# EAGLE design board (EAGLE 9.6.2)
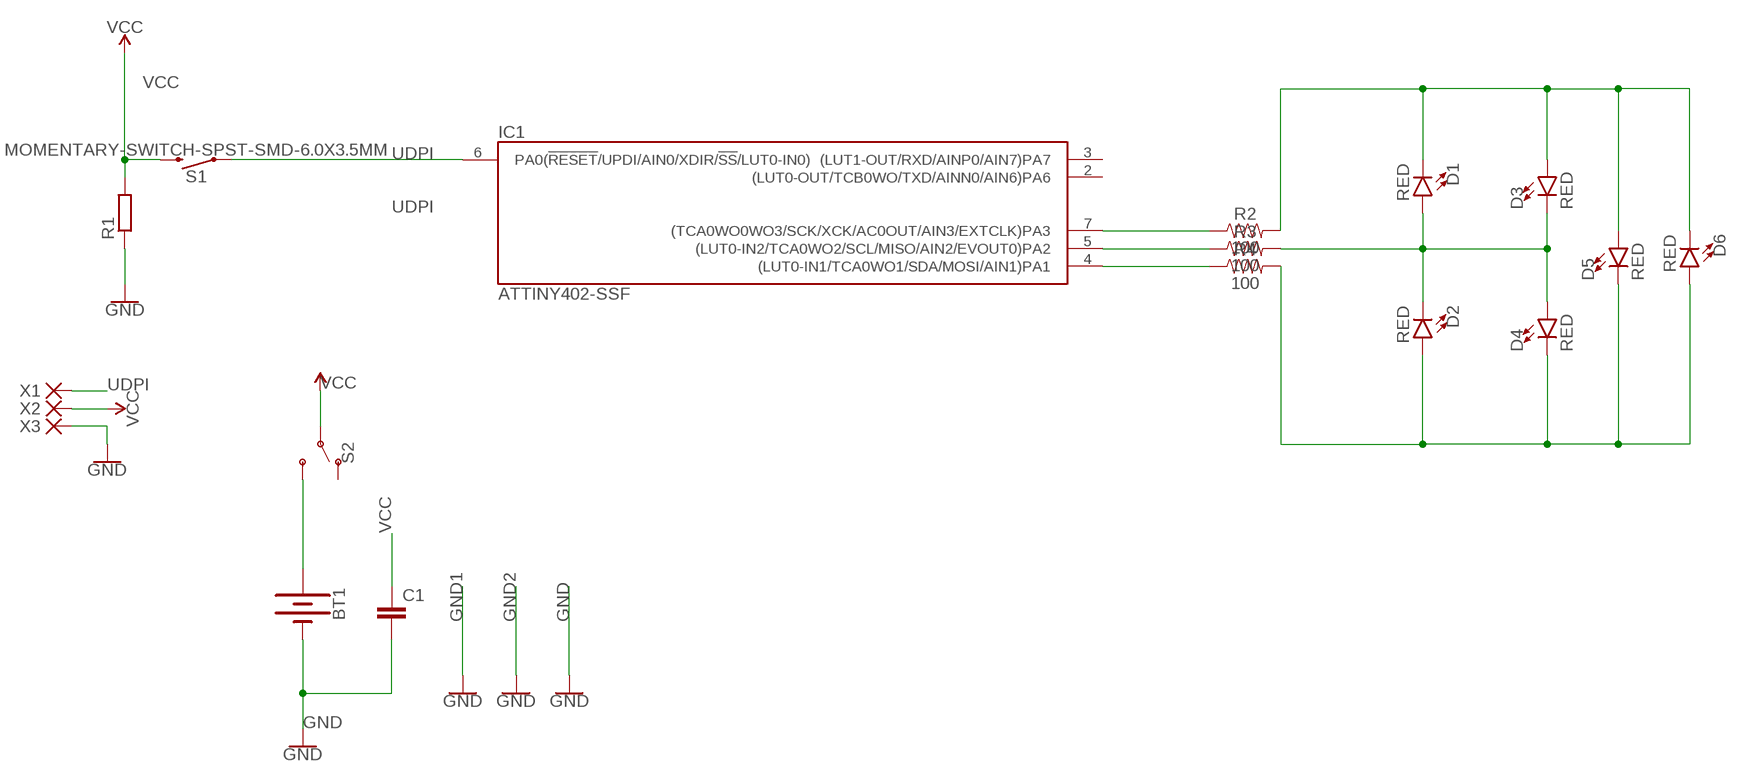
[diagram p0: schematic, sheet 1]

## Parts
BT1  BATTERY-20MM_SMD  [BATTCON_20MM]
C1  C-EUC0805  [C0805]
D1  RED  LED-RED0603  [LED-0603]
D2  RED  LED-RED0603  [LED-0603]
D3  RED  LED-RED0603  [LED-0603]
D4  RED  LED-RED0603  [LED-0603]
D5  RED  LED-RED0603  [LED-0603]
D6  RED  LED-RED0603  [LED-0603]
IC1  ATTINY402-SSF  [SO8]
R1  R-EU_R0603  [R0603]
R2  100  100OHM-0603-1/10W-1%  [0603]
R3  100  100OHM-0603-1/10W-1%  [0603]
R4  100  100OHM-0603-1/10W-1%  [0603]
S1  MOMENTARY-SWITCH-SPST-SMD-6.0X3.5MM  [TACTILE_SWITCH_SMD_6.0X3.5MM]
S2  SWITCH-SPDT-SMD-RIGHT-ANGLE  [SWITCH_SPST_SMD_A]
X1  PAD-1.27X2.54  [PAD-1.27X2.54]
X2  PAD-1.27X2.54  [PAD-1.27X2.54]
X3  PAD-1.27X2.54  [PAD-1.27X2.54]

## Nets
GND [New Class]: BT1.2(-) C1.2 R1.1 X3.1(P)
N$1: D1.C D3.A D5.A D6.C R2.2
N$2: IC1.7((TCA0WO0WO3/SCK/XCK/AC0OUT/AIN3/EXTCLK)PA3) R2.1
N$3: IC1.5((LUT0-IN2/TCA0WO2/SCL/MISO/AIN2/EVOUT0)PA2) R3.1
N$4: IC1.4((LUT0-IN1/TCA0WO1/SDA/MOSI/AIN1)PA1) R4.1
N$5: D2.A D4.C D5.C D6.A R4.2
N$6: BT1.1(+) S2.3(S)
N$7: D1.A D2.C D3.C D4.A R3.2
UDPI: IC1.6(PA0(!RESET!/UPDI/AIN0/XDIR/!SS!/LUT0-IN0)) S1.1 X1.1(P)
VCC: C1.1 R1.2 S1.2 S2.2(P) X2.1(P)
Unconnected: IC1.2((LUT0-OUT/TCB0WO/TXD/AINN0/AIN6)PA6) IC1.3((LUT1-OUT/RXD/AINP0/AIN7)PA7) S2.1(O)

## Power pins joined to a net without a drawn wire
GND: IC1.8(GND)
VCC: IC1.1(VCC)

## Library data of the parts
BT1 = SparkFun-Batteries:BATTERY: Battery - Single Cell A variety of battery chemistries, sizes, and footprints. Device List: 20MM_PTH - Coin Cell Battery Holder - 20mm (PTH) 20MM_PTH_KIT- Coin Cell battery Holder - 20 mm (PTH) kit version with special mask 6.8MM_PTH - Coin Cell Battery Holder - 6.8MM(SMD) 12MM_SMD - Coin Cell Battery Holder - 12mm (SMD) 12MM_PTH - Coin Cell Battery Holder - 12mm (PTH) 20MM_SMD - 20mm Coin Cell Battery Holder (SMD) (2 legs) Used on the Big Time Watch Kit 20MM_SMD_4LEGS - Coin Cell Battery Holder - 20mm (SMD) 20MM_SMD_4LEGS_OVERPASTE - Coin Cell Battery Holder - 20mm (SMD) (Over-paste on the legs) 24.5MM_PTH - Coin Cell Battery Holder - 24.5mm (PTH) 9V - 9V Battery Holder - PC Mount Used on the SparkFun SparkPunk Sound Kit and SparkFun SparkPunk Sequencer Kit 18650 - Battery Holder - 18650 (PTH) AA - Battery Holder - 1xAA (PTH) AAA - Battery Holder - 1xAAA (PTH) AA_KIT - Battery Holder - 1xAA (PTH) Special kit package - pads only have exposed copper on one side of the board. AAA_KIT - Battery Holder - 1xAAA (PTH) Special kit package - pads only have exposed copper on one side of the board.; PROD_ID: BATT-11519
C1 = rcl:C-EU: CAPACITOR, European symbol; SPICEPREFIX: C
D1-D6 = SparkFun-LED:LED-RED: Red SMD LED Used in manufacturing of most products at SparkFun Packages: 0603 - SMD 0603 package [Product Link] <http://docs.avagotech.com/docs/AV02-0551EN> 0603 SMART - SMD 0603 SMART package ( more efficient and expensive)[Product Link] <http://www.osram-os.com/Graphics/XPic2/00077099_0.pdf> 1206 - SMD1206 package [Product Link] <https://www.sparkfun.com/datasheets/DevTools/LilyPad/Q150OVS4.pdff> SparkFun Products: Pro Mini 328 -5V <https://www.sparkfun.com/products/821> RedBoard <https://www.sparkfun.com/products/12757> IOIO-OTG <https://www.sparkfun.com/products/13613>; PROD_ID: DIO-00819
IC1 = atmel (1):ATTINY*02: 8-bit AVR tiny-0-series Microcontroller CPU: two-cycle hardware multiplier single pin Unified Program Debug Interface (UPDI) programmable watchdog timer with separate on-chip oscillator programmable brown-out detection circuit with software disable function internal calibrated oscillator Status active active ATtiny202 ATtiny402 General purpose working registers 32 SRAM 128 B 256 B Flash 2 kB 4 kB EEPROM 64 B 128 B 16-bit Timer/Counter type A (TCA) 1 16-bit Timer/Counter type B (TCB) 1 Real Time Counter (RTC) 1 USART 1 SPI 1 TWI (I2C) 1 ADC 1 ADC channels 6 ADC resolution 10 bit AC 1 Custom Configurable Logic/Lookup tables 1/2 Window Watchdog 1 Event System channels 3 General purpose I/O 6 External interrupts 6 CRCSCAN 1 Operating voltage 1.8 ... 5.5 V Speed grade 0 ... 5 MHz @ 1.8 ... 5.5 V 0 ... 10 MHz @ 2.7 ... 5.5 V 0 ... 20 MHz @ 4.5 ... 5.5 V Clock options internal 16/20 MHz low power RC oscillator internal 32.768 kHz ultra low power RC oscillator external clock input Pin Name Other/Special ADC0 AC0 USART0 SPI0 TWI0 TCA0 TCB0 CCL PA0 !RESET, UPDI AIN0 XDIR !SS LUT0-IN0 PA1 AIN1 TxD MOSI SDA WO1 LUT0-IN1 PA2 EVOUT0 AIN2 RxD MISO SCL WO2 LUT0-IN2 PA3 EXTCLK AIN3 OUT XCK SCK WO0/WO3 PA6 AIN6 AINN0 TxD MOSI WO LUT0-OUT PA7 AIN7 AINP0 RxD MISO WO0 LUT1-OUT
R1 = rcl:R-EU_: RESISTOR, European symbol; SPICEPREFIX: R
R2-R4 = SparkFun-Resistors:100OHM: 100Ω resistor A resistor is a passive two-terminal electrical component that implements electrical resistance as a circuit element. Resistors act to reduce current flow, and, at the same time, act to lower voltage levels within circuits. - Wikipedia; PROD_ID: RES-07863
S1 = SparkFun-Switches:MOMENTARY-SWITCH-SPST: Momentary Switch (Pushbutton) - SPST Normally-open (NO) SPST momentary switches (buttons, pushbuttons). Variants PTH-12MM - 12mm square, through-hole Momentary Pushbutton Switch - 12mm Square (COM-09190) PTH-6.0MM, PTH-6.0MM-KIT - 6.0mm square, through-hole Mini Pushbutton Switch (COM-00097) KIT package intended for soldering kit's - only one side of pads' copper is exposed. PTH-RIGHT-ANGLE-KIT - Right-angle, through-hole Right Angle Tactile Button - Used on SparkFun BigTime Watch Kit SMD-12MM - 12mm square, surface-mount Tactile Button - SMD (12mm) (COM-12993) Used on SparkFun PicoBoard SMD-4.5MM - 4.5mm Square Trackball Switch Used on SparkFun Blackberry Trackballer Breakout SMD-4.6MMX2.8MM - 4.60mm x 2.80mm, surface mount Used on SparkFun SAMD21 Mini Breakout SMD-5.2MM, SMD-5.2-REDUNDANT - 5.2mm square, surface-mount Mini Pushbutton Switch - SMD (COM-08720) Used on Arduino Pro Mini REDUNDANT package connects both switch circuits together SMD-6.0X3.5MM - 6.0 x 3.5mm, surface mount Momentary Reset Switch SMD (COM-08229) SMD-6.2MM-TALL - 6.2mm square, surface mount Tactile Button - SMD (6mm) Used on SparkFun Digital Sandbox SMD-RIGHT-ANGLE - Right-angle, surface mount Used on SparkFun Block for Intel® Edison - Arduino; PROD_ID: SWCH-14278; SF_SKU: COM-08229
S2 = SparkFun-Switches:SWITCH-SPDT: Single Pole, Double Throw (SPDT) Switch Single-pole, double-throw (SPDT) switch. Variant Overview SMD-AYZ0202 Surface Mount DPDT Switch (COM-00597) Used on e.g. LilyPad Arduino USB - ATmega32U4 Board PTH-11.6X4.0MM SPDT Mini Power Switch (COM-00102) Used on e.g. SparkFun Simon Says - Through-Hole Soldering Kit (KIT-10547) PTH-11.6X4.0MM-KIT KIT version of SPDT Mini Power Switch - Simplifies soldering by removing tStop of switch pins - only one side can be soldered. PTH-11.6X4.0MM-LOCK LOCK version of SPDT Mini Power Switch - Offset pins hold switch in place for easier soldering. SMD-RIGHT-ANGLE Surface Mount Right Angle Switch (COM-10860) Used on e.g. SparkFun ESP8266 Thing; PROD_ID: SWCH-10651; SF_SKU: COM-10860
X1-X3 = we-rcl:PAD: Pad / Test-Point

## Board
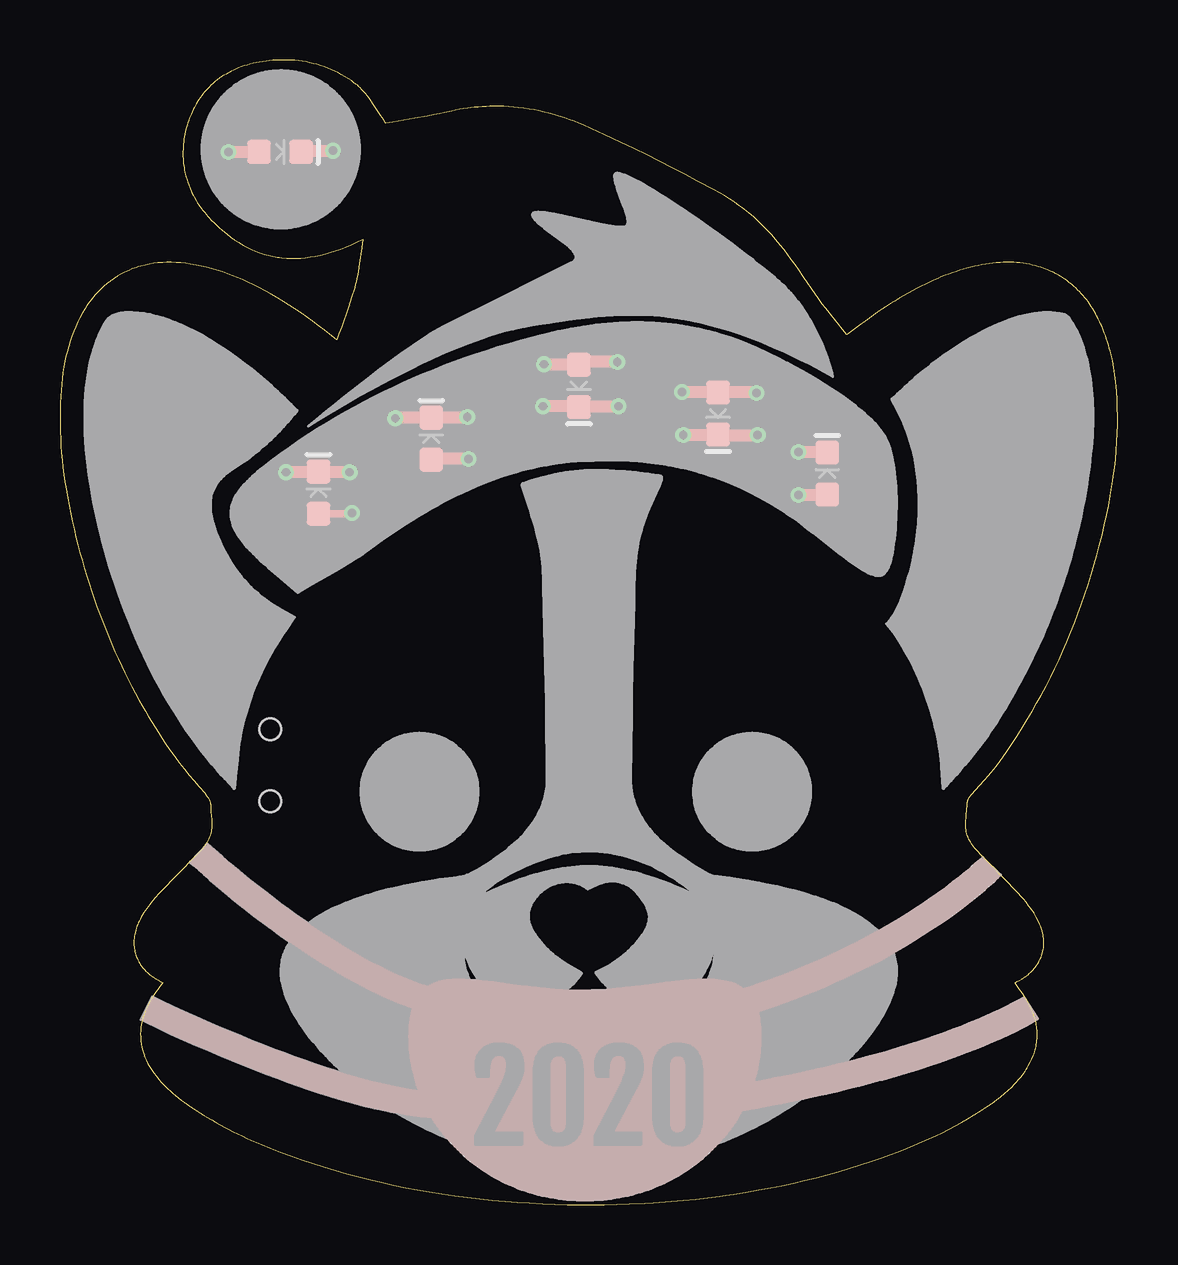
[diagram p1: board, top side]
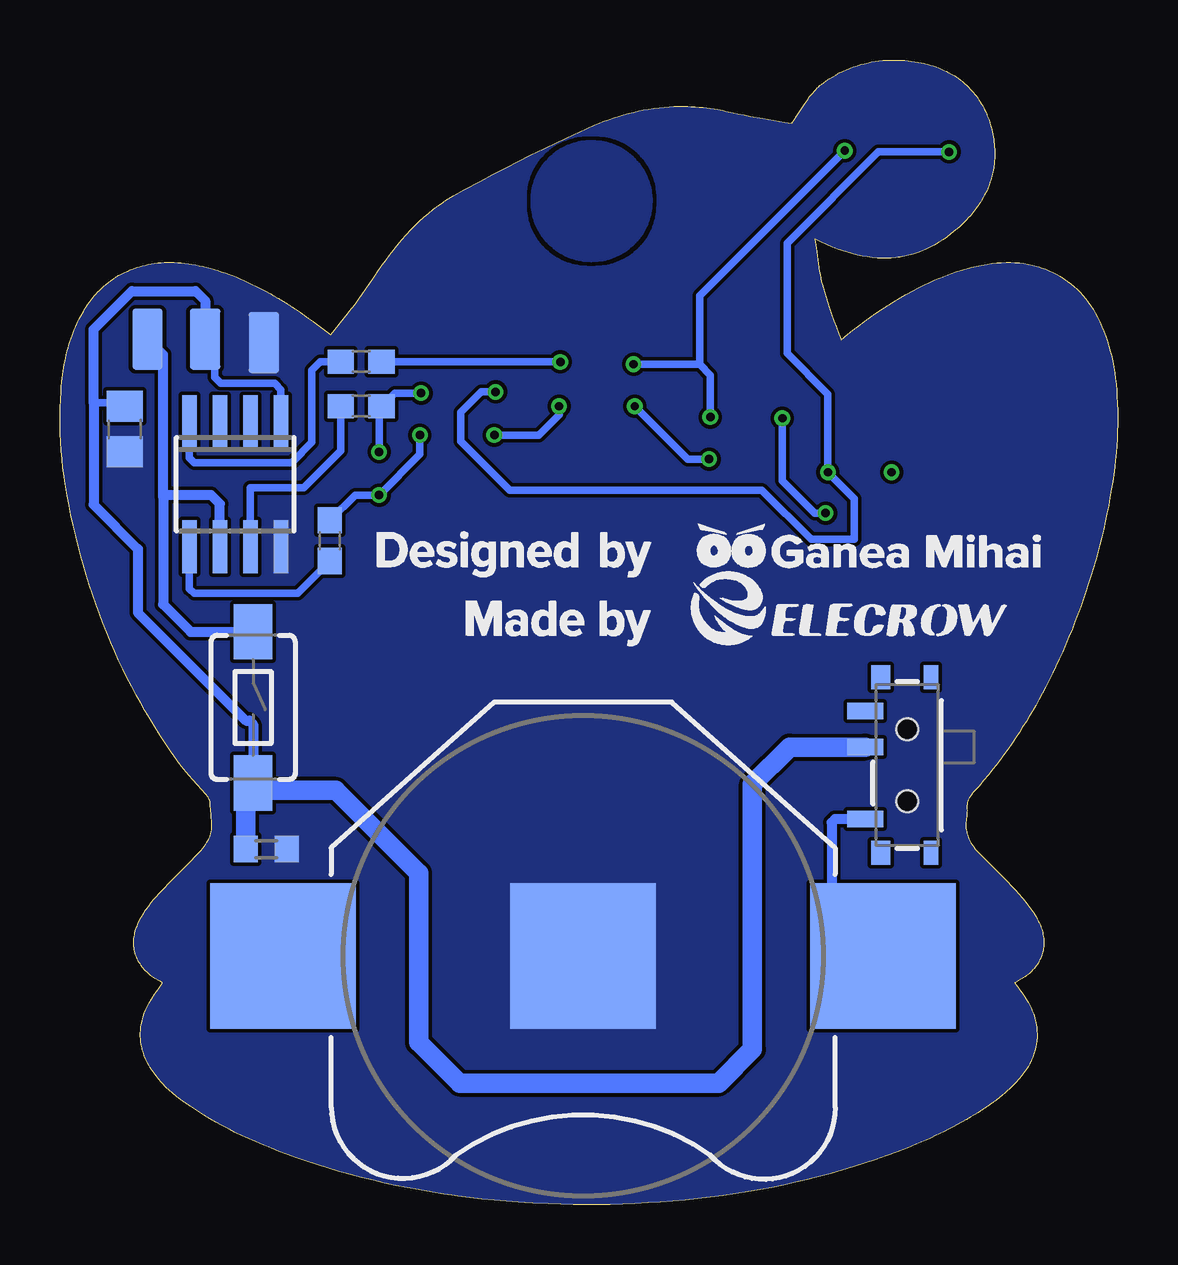
[diagram p2: board, bottom side, seen from below]

Size 44.07 x 47.7 mm. Coordinates in mm from the lower left corner, seen from the top.
Outline: 852 segments
Copper layers (1*16): Top 0.035mm / dielectric 1.6mm / Bottom 0.035mm
Design rules "Elecrow_2-layer_PCB_eagle_rule *": minimum track width 6mil, minimum drill 12mil, track to track 6mil, track to pad 6mil, pad to pad 6mil, via to via 8mil, smd to smd 0mil, copper to edge 0mil, drill to drill 10mil, minimum pad ring 6mil, minimum via ring 6mil, stop-mask expansion 0mil, vias tented up to drill 100mil, thermal gap 0mil
tRestrict: area 1,17.3 to 9.9,37.2; area 34.4,17.3 to 43,37.2; area 17.3,2.5 to 19.3,6.7; area 19.7,2.5 to 21.8,6.7; area 22.3,2.5 to 24.3,6.7; area 24.7,2.5 to 26.8,6.7

### Footprints (pad centres in the part's own frame; a part is rotated, then mirrored left to right if it is on the bottom)
BATTCON_20MM = smd 6.07 x 6.07: 1 -12.5,0; 2 0,0; 3 12.5,0
C0805 = smd 1.3 x 1.5: 1 -0.95,0; 2 0.95,0
LED-0603 = smd 1 x 1: A -0.877,0; C 0.877,0
SO8 = smd 0.6 x 2.2: 1 -1.905,-2.6; 2 -0.635,-2.6; 3 0.635,-2.6; 4 1.905,-2.6; 5 1.905,2.6; 6 0.635,2.6; 7 -0.635,2.6; 8 -1.905,2.6
R0603 = smd 1 x 1.1: 1 -0.85,0; 2 0.85,0
0603 = smd 1.1 x 1: 1 -0.85,0; 2 0.85,0
TACTILE_SWITCH_SMD_6.0X3.5MM = smd 2.3 x 1.6: 1 -3.15,0; 2 3.15,0
SWITCH_SPST_SMD_A = smd 0.7 x 1.5: 1 -2.25,-1.75; 2 -0.75,-1.75; 3 2.25,-1.75 | smd 1 x 0.6: GND1 -3.65,1; GND3 3.65,1 | smd 1 x 0.8: GND2 -3.65,-1.1; GND4 3.65,-1.1 | hole 0.9: -1.5,0; 1.5,0
PAD-1.27X2.54 = smd 1.27 x 2.54: 1 0,0

### Placement (x,y rotation side)
BT1  22.27,10.37 180 bottom
C1  41.37,32.32 270 bottom
D1  31.97,30.47 90 top
D2  21.62,34.12 270 top
D3  27.42,32.97 270 top
D4  15.47,31.92 90 top
D5  9.17,43.87 0 top
D6  10.77,29.67 90 top
IC1  36.77,30.02 180 bottom
R1  35.47,14.82 180 bottom
R2  31.52,33.27 0 bottom
R3  32.82,27.67 90 bottom
R4  31.52,35.12 0 bottom
S1  36.02,20.72 270 bottom
S2  8.77,18.32 270 bottom
X1  40.42,36.07 0 bottom
X2  38.02,36.07 0 bottom
X3  35.57,35.92 0 bottom

### Tracks (layer width: path | path; a pad name or v marks a point on that pad's centre or on a via)
GND
  pour Top (rank 3): 228 corners
  pour Top (rank 3): 230 corners
  pour Top (rank 3): 230 corners
  pour Top (no thermals): 15.72,7.9 15.95,8.93 15.71,8.99 15.47,9.06 15.24,9.13 14.97,9.22 14.7,9.31 14.44,9.42 14.18,9.52 13.89,9.65 13.6,9.79 13.32,9.93 13.03,10.07 12.72,10.24 12.42,10.41 12.11,10.58 11.81,10.77 11.51,10.95 11.18,11.16 10.85,11.37 10.53,11.58 10.21,11.8 9.86,12.05 9.52,12.3 9.18,12.55 8.84,12.8 8.48,13.08 8.15,13.34 7.79,13.63 7.46,13.9 7.11,14.19 6.76,14.49 6.44,14.77 6.16,15.03 6.13,15.03 5.43,14.28 5.43,14.26 5.59,14.12 5.8,13.93 6.01,13.74 6.25,13.53 6.49,13.33 6.87,13.01 7.28,12.68 7.66,12.37 8.08,12.04 8.45,11.77 8.82,11.49 9.19,11.22 9.53,10.98 9.88,10.74 10.23,10.5 10.59,10.27 10.94,10.05 11.28,9.85 11.61,9.65 11.92,9.47 12.26,9.28 12.57,9.12 12.88,8.96 13.2,8.81 13.49,8.67 13.78,8.55 14.07,8.42 14.37,8.31 14.63,8.21 14.9,8.12 15.17,8.04 15.44,7.97 15.58,7.93
  pour Top (rank 3): 16.08,3.61 16.08,4.67 15.87,4.67 15.63,4.68 15.38,4.7 15.1,4.73 14.82,4.77 14.54,4.81 14.23,4.87 13.91,4.93 13.6,4.99 13.26,5.08 12.95,5.15 12.58,5.25 12.2,5.36 11.83,5.47 11.46,5.58 11.06,5.71 10.62,5.85 10.22,5.99 9.79,6.15 9.36,6.3 8.93,6.47 8.47,6.64 7.98,6.84 7.55,7.01 7.09,7.2 6.57,7.42 6.09,7.63 5.64,7.83 5.15,8.05 4.7,8.25 4.22,8.48 3.84,8.66 3.82,8.63 3.37,7.72 3.4,7.7 3.53,7.64 4.1,7.36 4.64,7.11 5.16,6.88 5.67,6.65 6.19,6.43 6.71,6.21 7.17,6.02 7.63,5.83 8.32,5.56 8.35,5.55 8.37,5.54 9.04,5.29 9.47,5.13 9.94,4.97 10.37,4.82 10.81,4.67 11.21,4.55 11.62,4.42 11.99,4.32 12.37,4.21 12.74,4.11 13.08,4.03 13.43,3.95 13.77,3.88 14.12,3.81 14.43,3.76 14.75,3.71 15.03,3.67 15.31,3.65 15.59,3.62 15.84,3.61
  pour Top (rank 3): 27.83,7.68 28.27,7.8 28.67,7.93 29.08,8.06 29.48,8.19 29.88,8.33 30.28,8.47 30.67,8.62 31.1,8.79 31.49,8.95 31.88,9.11 32.27,9.28 32.65,9.46 33.04,9.64 34.17,10.19 35.24,10.82 35.58,11.02 35.93,11.24 36.29,11.47 36.61,11.68 36.96,11.92 37.28,12.15 37.62,12.4 37.92,12.64 38.23,12.88 38.53,13.13 38.79,13.36 38.95,13.5 39.08,13.62 39.18,13.72 39.2,13.75 38.46,14.46 38.44,14.48 38.34,14.38 38.23,14.29 38,14.08 37.76,13.87 37.48,13.65 37.21,13.43 36.9,13.2 36.58,12.97 36.27,12.74 35.95,12.52 35.62,12.31 35.3,12.1 34.97,11.9 34.25,11.47 33.63,11.14 33.21,10.92 32.87,10.74 32.49,10.56 32.13,10.39 31.78,10.23 31.39,10.06 31.04,9.91 30.64,9.75 30.28,9.61 29.89,9.46 29.52,9.33 29.12,9.19 28.75,9.06 28.35,8.94 27.98,8.82 27.54,8.7
  pour Top (rank 3): 28.05,3.87 28.57,3.96 29.06,4.05 29.54,4.14 30.03,4.23 30.51,4.33 30.96,4.42 31.48,4.53 31.93,4.63 32.38,4.74 32.82,4.84 33.3,4.96 33.74,5.08 34.19,5.2 34.26,5.2 35.79,5.68 36.21,5.81 36.62,5.95 37.02,6.09 37.41,6.23 37.78,6.37 38.14,6.51 38.5,6.65 38.86,6.8 39.21,6.96 39.53,7.11 39.85,7.26 40.04,7.35 40.2,7.44 40.48,7.59 40.6,7.66 40.72,7.73 40.73,7.75 40.18,8.62 40.15,8.63 39.97,8.52 39.72,8.38 39.44,8.24 39.15,8.1 38.87,7.97 38.54,7.83 38.22,7.69 37.89,7.55 37.56,7.42 37.2,7.28 36.84,7.15 36.47,7.02 36.1,6.9 35.74,6.77 35.31,6.64 34.2,6.29 34.16,6.29 34.15,6.29 33.74,6.18 33.3,6.06 32.85,5.95 32.44,5.84 32,5.74 31.58,5.64 31.14,5.54 30.69,5.44 30.27,5.36 29.79,5.26 29.34,5.17 28.85,5.09 28.36,5 27.88,4.92
  pour Bottom (rank 3): 838 corners
  pour Bottom (rank 3): 24.42,41.82 24.41,41.98 24.41,42.08 24.4,42.14 24.38,42.24 24.36,42.34 24.34,42.45 24.31,42.55 24.28,42.65 24.24,42.75 24.22,42.8 24.18,42.89 24.13,42.99 24.1,43.04 24.05,43.13 23.99,43.22 23.93,43.3 23.87,43.39 23.83,43.43 23.8,43.47 23.73,43.54 23.65,43.62 23.58,43.69 23.5,43.76 23.45,43.79 23.41,43.82 23.33,43.89 23.24,43.94 23.19,43.97 23.1,44.02 23.01,44.07 22.91,44.12 22.81,44.16 22.76,44.17 22.66,44.21 22.56,44.24 22.46,44.26 22.35,44.28 22.25,44.3 22.14,44.31 21.99,44.32 21.88,44.32 21.77,44.32 21.62,44.3 21.51,44.29 21.41,44.27 21.3,44.24 21.2,44.21 21.1,44.18 21,44.15 20.95,44.13 20.9,44.1 20.81,44.06 20.72,44.01 20.62,43.96 20.53,43.9 20.45,43.84 20.36,43.78 20.32,43.74 20.28,43.71 20.2,43.64 20.13,43.56 20.09,43.53 20.02,43.45 19.95,43.36 19.89,43.28 19.83,43.19 19.8,43.15 19.77,43.1 19.72,43.01 19.67,42.92 19.63,42.82 19.59,42.72 19.55,42.62 19.54,42.57 19.51,42.47 19.48,42.37 19.46,42.27 19.44,42.16 19.43,42.06 19.42,41.9 19.42,41.79 19.42,41.69 19.43,41.58 19.44,41.53 19.45,41.42 19.47,41.32 19.48,41.27 19.51,41.17 19.54,41.06 19.57,40.96 19.61,40.87 19.63,40.82 19.67,40.72 19.72,40.63 19.77,40.53 19.83,40.45 19.89,40.36 19.95,40.27 19.99,40.23 20.02,40.19 20.09,40.11 20.17,40.04 20.2,40 20.28,39.93 20.36,39.86 20.45,39.8 20.53,39.74 20.58,39.71 20.62,39.68 20.72,39.63 20.81,39.58 20.9,39.53 21,39.49 21.1,39.46 21.2,39.42 21.25,39.41 21.36,39.38 21.46,39.36 21.56,39.34 21.67,39.33 21.77,39.32 21.93,39.32 22.04,39.32 22.14,39.33 22.25,39.34 22.3,39.35 22.41,39.37 22.46,39.38 22.56,39.4 22.66,39.43 22.76,39.46 22.86,39.5 22.91,39.52 23.01,39.57 23.1,39.62 23.19,39.67 23.28,39.72 23.33,39.75 23.41,39.81 23.5,39.88 23.58,39.95 23.65,40.02 23.69,40.06 23.73,40.09 23.8,40.17 23.87,40.25 23.93,40.34 23.96,40.38 24.02,40.47 24.05,40.51 24.1,40.6 24.15,40.7 24.2,40.79 24.24,40.89 24.28,40.99 24.31,41.09 24.34,41.19 24.35,41.24 24.37,41.35 24.39,41.45 24.41,41.56 24.41,41.66
GND1
  pour Bottom: 19.42,41.69 19.42,41.79 19.42,41.9 19.43,42.06 19.44,42.16 19.46,42.27 19.48,42.37 19.51,42.47 19.54,42.57 19.55,42.62 19.59,42.72 19.63,42.82 19.67,42.92 19.72,43.01 19.77,43.1 19.8,43.15 19.83,43.19 19.89,43.28 19.95,43.36 20.02,43.45 20.09,43.53 20.13,43.56 20.2,43.64 20.28,43.71 20.32,43.74 20.36,43.78 20.49,43.87 20.62,43.96 20.72,44.01 20.81,44.06 20.9,44.1 20.95,44.13 21,44.15 21.1,44.18 21.2,44.21 21.3,44.24 21.41,44.27 21.51,44.29 21.62,44.3 21.77,44.32 21.88,44.32 21.99,44.32 22.14,44.31 22.25,44.3 22.35,44.28 22.46,44.26 22.56,44.24 22.66,44.21 22.76,44.17 22.81,44.16 22.91,44.12 23.01,44.07 23.1,44.02 23.19,43.97 23.24,43.94 23.33,43.89 23.41,43.82 23.45,43.79 23.5,43.76 23.58,43.69 23.65,43.62 23.73,43.54 23.8,43.47 23.83,43.43 23.87,43.39 23.93,43.3 23.99,43.22 24.05,43.13 24.1,43.04 24.13,42.99 24.18,42.89 24.22,42.8 24.24,42.75 24.28,42.65 24.31,42.55 24.34,42.45 24.36,42.34 24.38,42.24 24.4,42.14 24.41,42.08 24.41,41.98 24.42,41.82 24.41,41.66 24.41,41.56 24.39,41.45 24.37,41.35 24.35,41.24 24.34,41.19 24.31,41.09 24.28,40.99 24.24,40.89 24.2,40.79 24.15,40.7 24.1,40.6 24.05,40.51 24.02,40.47 23.96,40.38 23.93,40.34 23.87,40.25 23.8,40.17 23.73,40.09 23.69,40.06 23.65,40.02 23.58,39.95 23.5,39.88 23.41,39.81 23.33,39.75 23.28,39.72 23.19,39.67 23.1,39.62 23.01,39.57 22.91,39.52 22.86,39.5 22.76,39.46 22.66,39.43 22.56,39.4 22.46,39.38 22.41,39.37 22.3,39.35 22.25,39.34 22.14,39.33 22.04,39.32 21.93,39.32 21.77,39.32 21.67,39.33 21.56,39.34 21.46,39.36 21.36,39.38 21.25,39.41 21.2,39.42 21.1,39.46 21,39.49 20.9,39.53 20.81,39.58 20.72,39.63 20.62,39.68 20.58,39.71 20.53,39.74 20.45,39.8 20.36,39.86 20.28,39.93 20.2,40 20.17,40.04 20.09,40.11 20.02,40.19 19.99,40.23 19.95,40.27 19.89,40.36 19.83,40.45 19.77,40.53 19.72,40.63 19.67,40.72 19.63,40.82 19.61,40.87 19.57,40.96 19.54,41.06 19.51,41.17 19.48,41.27 19.47,41.32 19.45,41.42 19.44,41.53 19.43,41.58
N$1  (via drill 0.35)
  Top 0.305: D6.C 10.8,30.52 | 30.79,31.35 v30.77,31.37
  Top 0.406: 10.74,30.52 D6.C
  Top 0.508: v29.02,33.82 28.99,33.85 D3.A 25.94,33.85 v25.92,33.87 | 10.74,30.52 v9.42,30.52 | v12.07,30.52 10.8,30.52 | v7.02,43.87 D5.A | D1.C 30.79,31.35
  Bottom 0.305: v7.02,43.87 9.97,43.87 13.77,40.07 13.77,35.47 12.07,33.77 v12.07,30.52 10.97,29.42 10.97,27.72 12.77,27.72 14.82,29.77 25.32,29.77 27.37,31.82 27.37,33.02 26.52,33.87 v25.92,33.87 | v29.02,33.82 30.12,33.82 R2.2 30.77,33.17 v30.77,31.37
N$2
  Bottom 0.305: R2.1 32.37,31.42 33.92,29.87 36.13,29.87 IC1.7
  Bottom 0.406: 32.32,33.22 R2.1
N$3
  Bottom 0.305: R3.1 34.17,25.47 38.47,25.47 38.67,25.67 IC1.5
N$4
  Bottom 0.305: IC1.4 38.67,31.12 38.47,30.92 34.42,30.92 33.57,31.77 33.57,34.77 33.22,35.12 R4.1
N$5  (via drill 0.35)
  Top 0.305: 21.74,35.12 D2.A | 20.19,35 v20.17,35.02 | v16.97,32.82 16.95,32.8 | v13.97,32.77 13.97,32.8 | v12.17,28.82 12.17,28.79 D6.A | D5.C 10.1,43.92
  Top 0.508: v23.22,35.12 21.74,35.12 | D2.A 20.19,35 | 16.95,32.8 D4.C 13.97,32.8 | 10.1,43.92 v11.37,43.92
  Bottom 0.305: 23.22,35.17 v23.22,35.12 R4.2 | v20.17,35.02 17.42,35.02 | 17.42,35.02 16.97,34.57 v16.97,32.82 | v13.97,32.77 13.97,30.17 12.62,28.82 v12.17,28.82 | v11.37,43.92 17.42,37.87 17.42,35.02
N$6
  Bottom 0.406: S2.3 11.77,16.07 11.92,15.92 11.92,11.72 10.57,10.37 BT1.1
N$7  (via drill 0.35)
  Top 0.305: D1.A 31.95,29.57
  Top 0.508: v17.02,31.07 17,31.09 15.52,31.09 D4.A | v20.12,33.27 21.59,33.27 D2.C 21.65,33.27 v23.27,33.27 | v29.07,32.07 27.44,32.07 D3.C 27.4,32.07 v25.97,32.07 | 31.95,29.57 v30.77,29.57
  Bottom 0.305: v23.27,33.27 23.27,32.92 24.12,32.07 v25.97,32.07 | v20.12,33.27 17.92,31.07 v17.02,31.07 | v29.07,32.07 29.07,31.27 v30.77,29.57 31.77,29.57 R3.2
UDPI
  Bottom 0.406: 36.42,24.27 S1.1 38.62,23.87 39.77,25.02 39.77,29.52 | X1.1 39.77,35.42 39.77,29.52 | IC1.6 37.4,29.2 37.77,29.57 39.72,29.57 39.77,29.52
VCC
  Bottom 0.152: C1.1 41.32,33.22
  Bottom 0.305: X2.1 38,36.09 | X2.1 38.02,36.67 | IC1.1 34.86,33.96 35.12,34.22 37.37,34.22 37.62,34.47 37.62,35.67 X2.1 | C1.1 41.52,33.42 42.67,33.42
  Bottom 0.406: IC1.1 | X2.1 38.02,37.67 38.42,38.07 41.07,38.07 42.67,36.47 42.67,33.42 42.67,29.17 40.82,27.32 40.82,24.67 36.32,20.17 36.17,20.17 36.02,20.02 S1.2
  Bottom 0.508: 36.02,17.52 S1.2
  Bottom 0.813: S2.2 13.67,19.07 15.22,17.52 15.22,6.47 16.62,5.07 27.42,5.07 29.12,6.77 29.12,13.82 32.57,17.27 35.72,17.27 | R1.2 36.32,17.27 35.72,17.27 | 35.72,17.27 S1.2